# Altium schematic sheet QCopterMV_IMU_Sch.SchDoc: QCopterMV-IMU
size 127 x 101 mm; Author: Hom; CompanyName: KitSprout; DrawnBy: Hom; Engineer: Hom; Organization: KitSprout; Revision: A; SheetNumber: 1; SheetTotal: 1; License: CC BY-SA 4.0; Version: 2.0; LibVersion: 2.7; PageSetup: Record=PageOptions|CenterHorizontal=True|CenterVertical=True|PrintScale=1.00|XCorrection=1.00|YCorrection=1.00|PrintKind=0|BorderSize=5000000|LeftOffset=0|BottomOffset=0|Orientation=2|PaperLength=1000|PaperWidth=1000|Scale=100|PaperSource=7|PrintQuality=-4|MediaType=1|DitherType=10|PaperKind=A4|PrintScaleMode=0
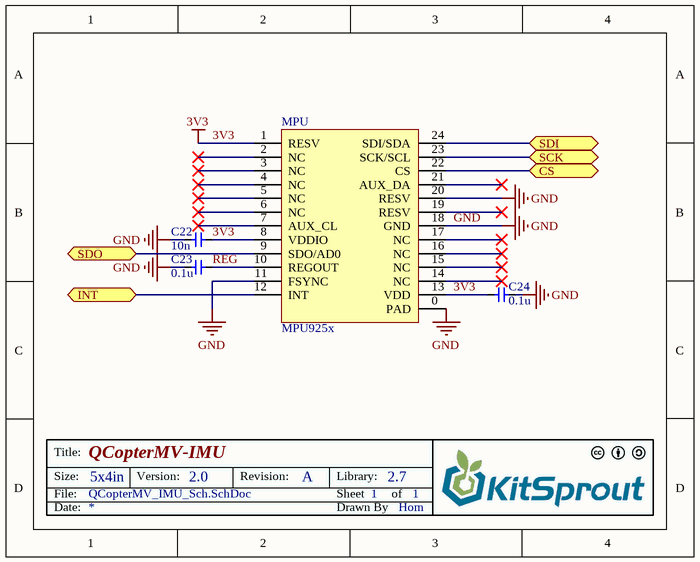
[diagram p0: QCopterMV_IMU_Sch.SchDoc]

## Parts
C22  value 10n  [CAP_0402]  (hidden comment: Cap_0402)
C23  value 0.1u  [CAP_0402]  (hidden comment: Cap_0402)
C24  value 0.1u  [CAP_0402]  (hidden comment: Cap_0402)
MPU  MPU925x  [QFN_P0.4_24]

## Ports
CS, INT, SCK, SDI, SDO

## Nets
3V3: C22.2 C24.1 MPU.1(RESV) MPU.8(VDDIO) MPU.13(VDD)
GND: C22.1 C23.1 C24.2 MPU.0(PAD) MPU.11(FSYNC) MPU.18(GND) MPU.20(RESV)
CS: MPU.22(CS) ; port CS
INT: MPU.12(INT) ; port INT
REG: C23.2 MPU.10(REGOUT)
SCK: MPU.23(SCK/SCL) ; port SCK
SDI: MPU.24(SDI/SDA) ; port SDI
SDO: MPU.9(SDO/AD0) ; port SDO

Not connected (* = marked no-connect by the designer): MPU 2(NC)* 3(NC)* 4(NC)* 5(NC)* 6(NC)* 7(AUX_CL)* 14(NC)* 15(NC)* 16(NC)* 17(NC)* 19(RESV)* 21(AUX_DA)*

## Notes on the sheet
- Title:
- Size:
- Date:
- File:
- 5x4in
- Version:
- Revision:
- Sheet
- Drawn By
- Library:
- of

## Library data of the parts
C22-C24 = Cap_0402: Capacitor
MPU = MPU925x: Sensor Motion